# EAGLE schematic VCO (EAGLE 9.5.1)
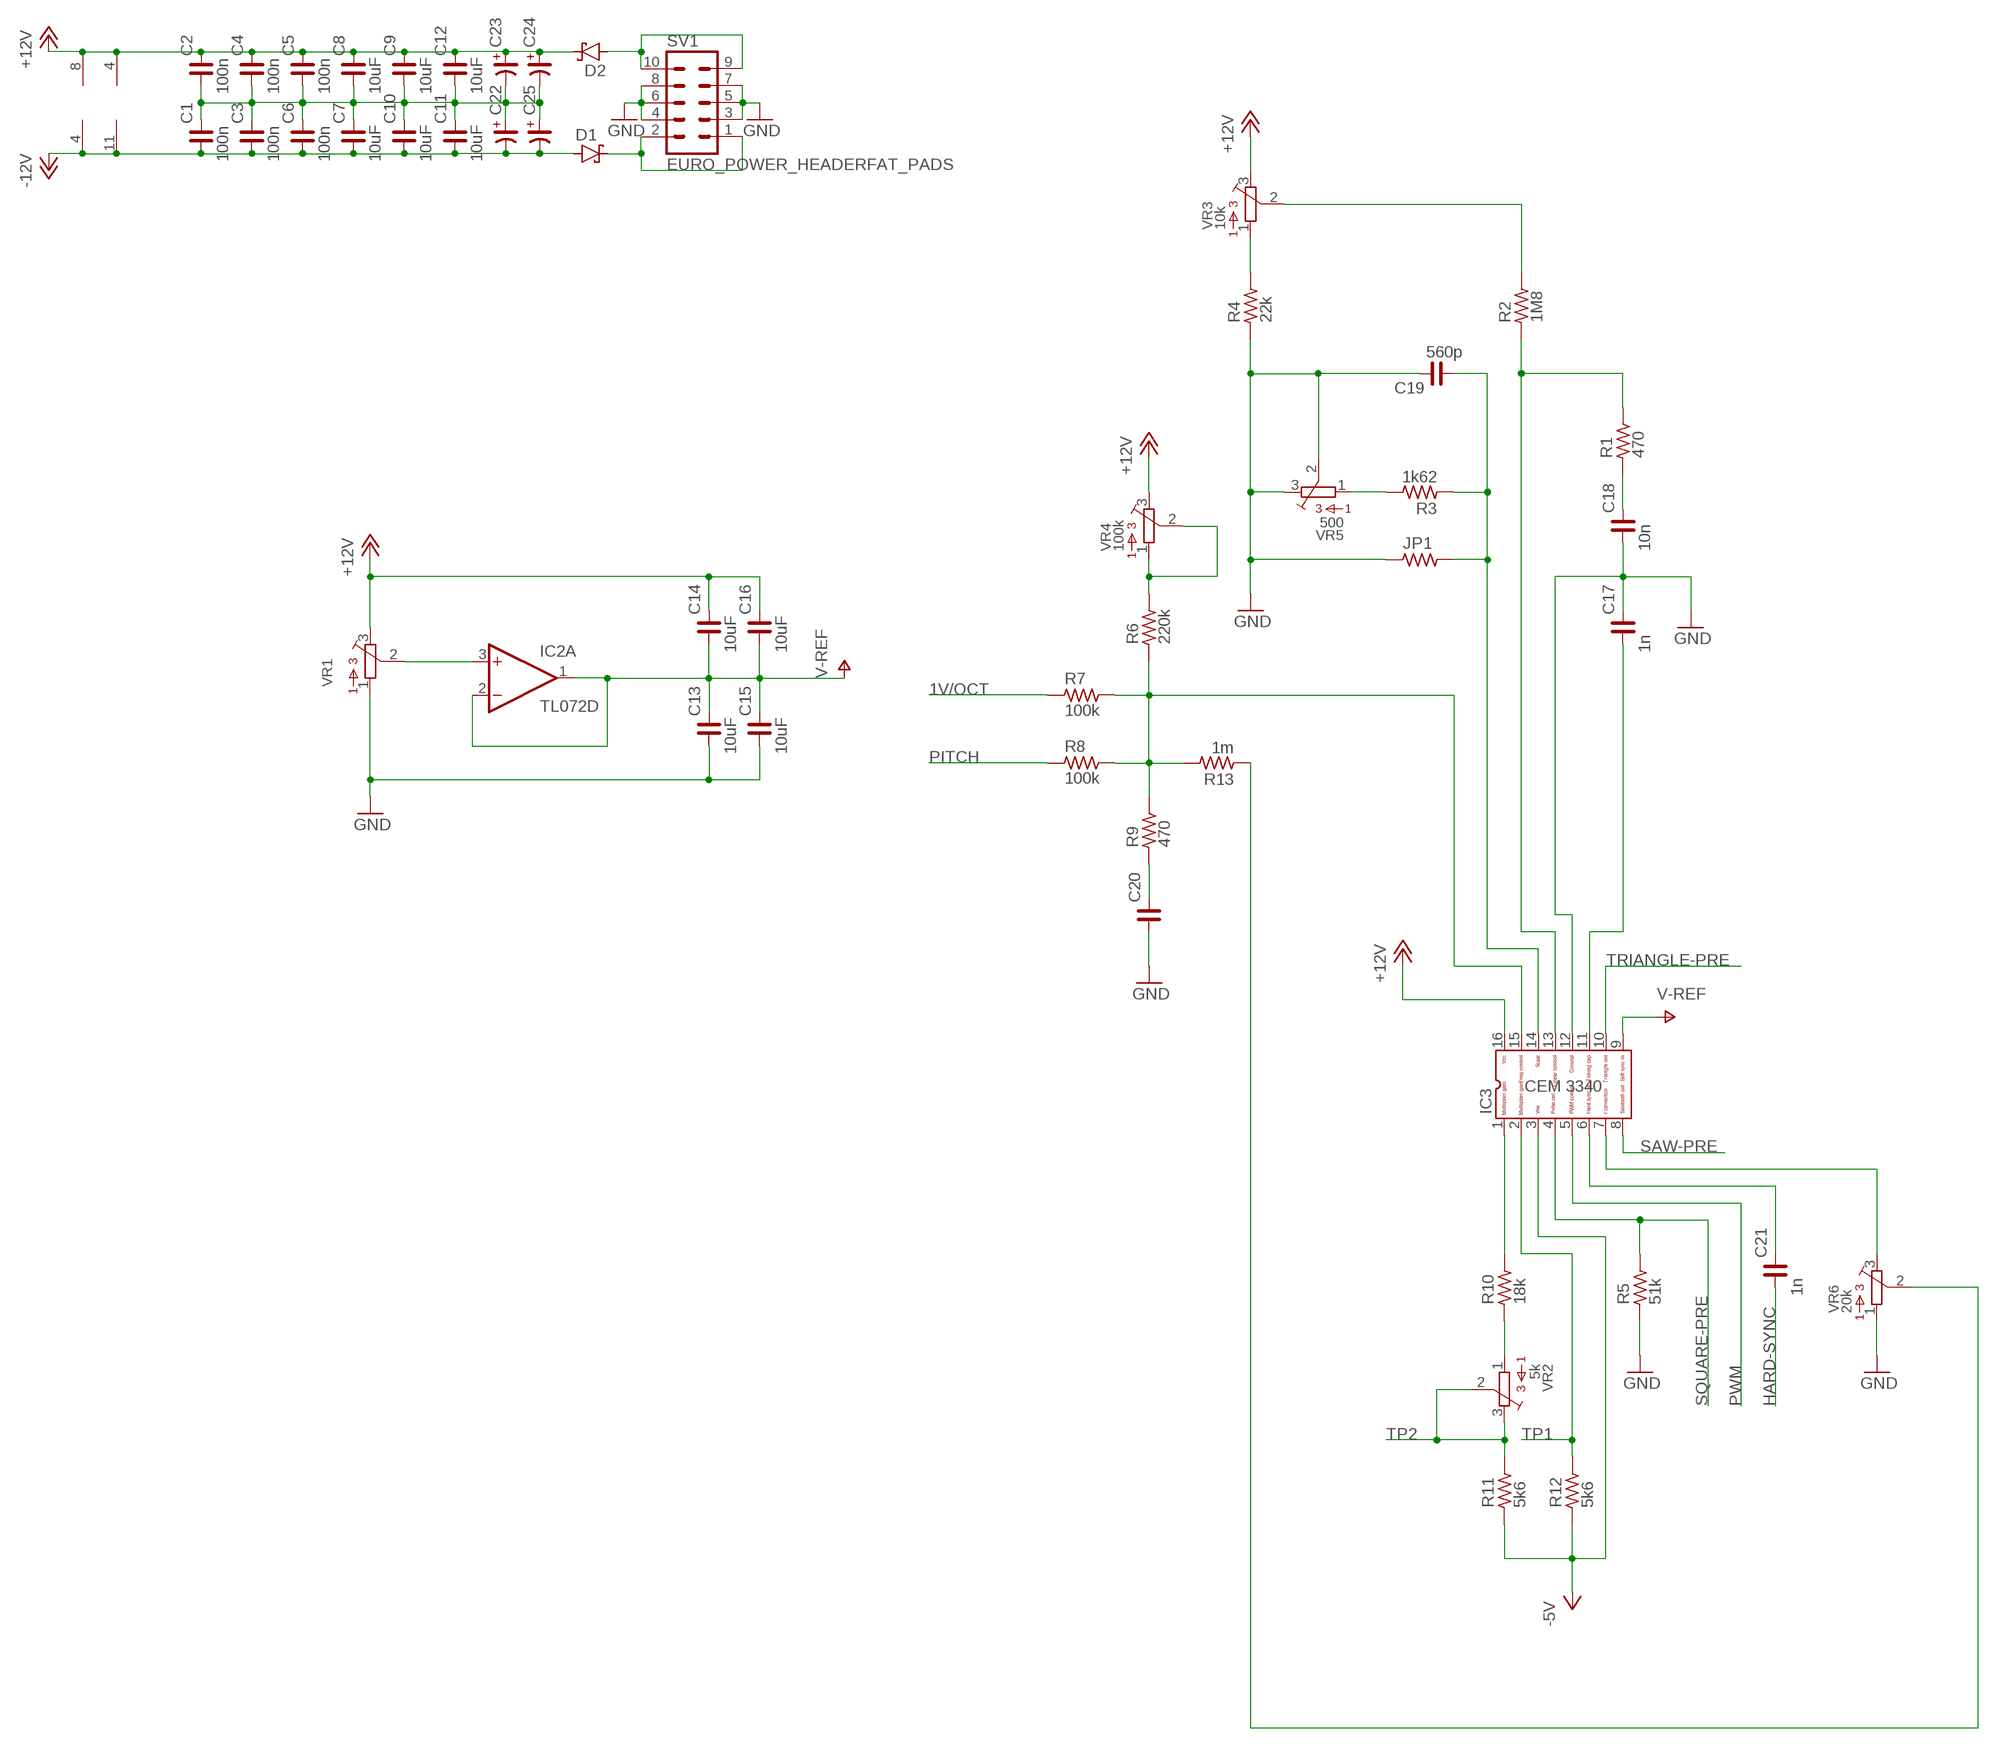
[diagram p0: schematic, sheet 1, part 1 of 2]
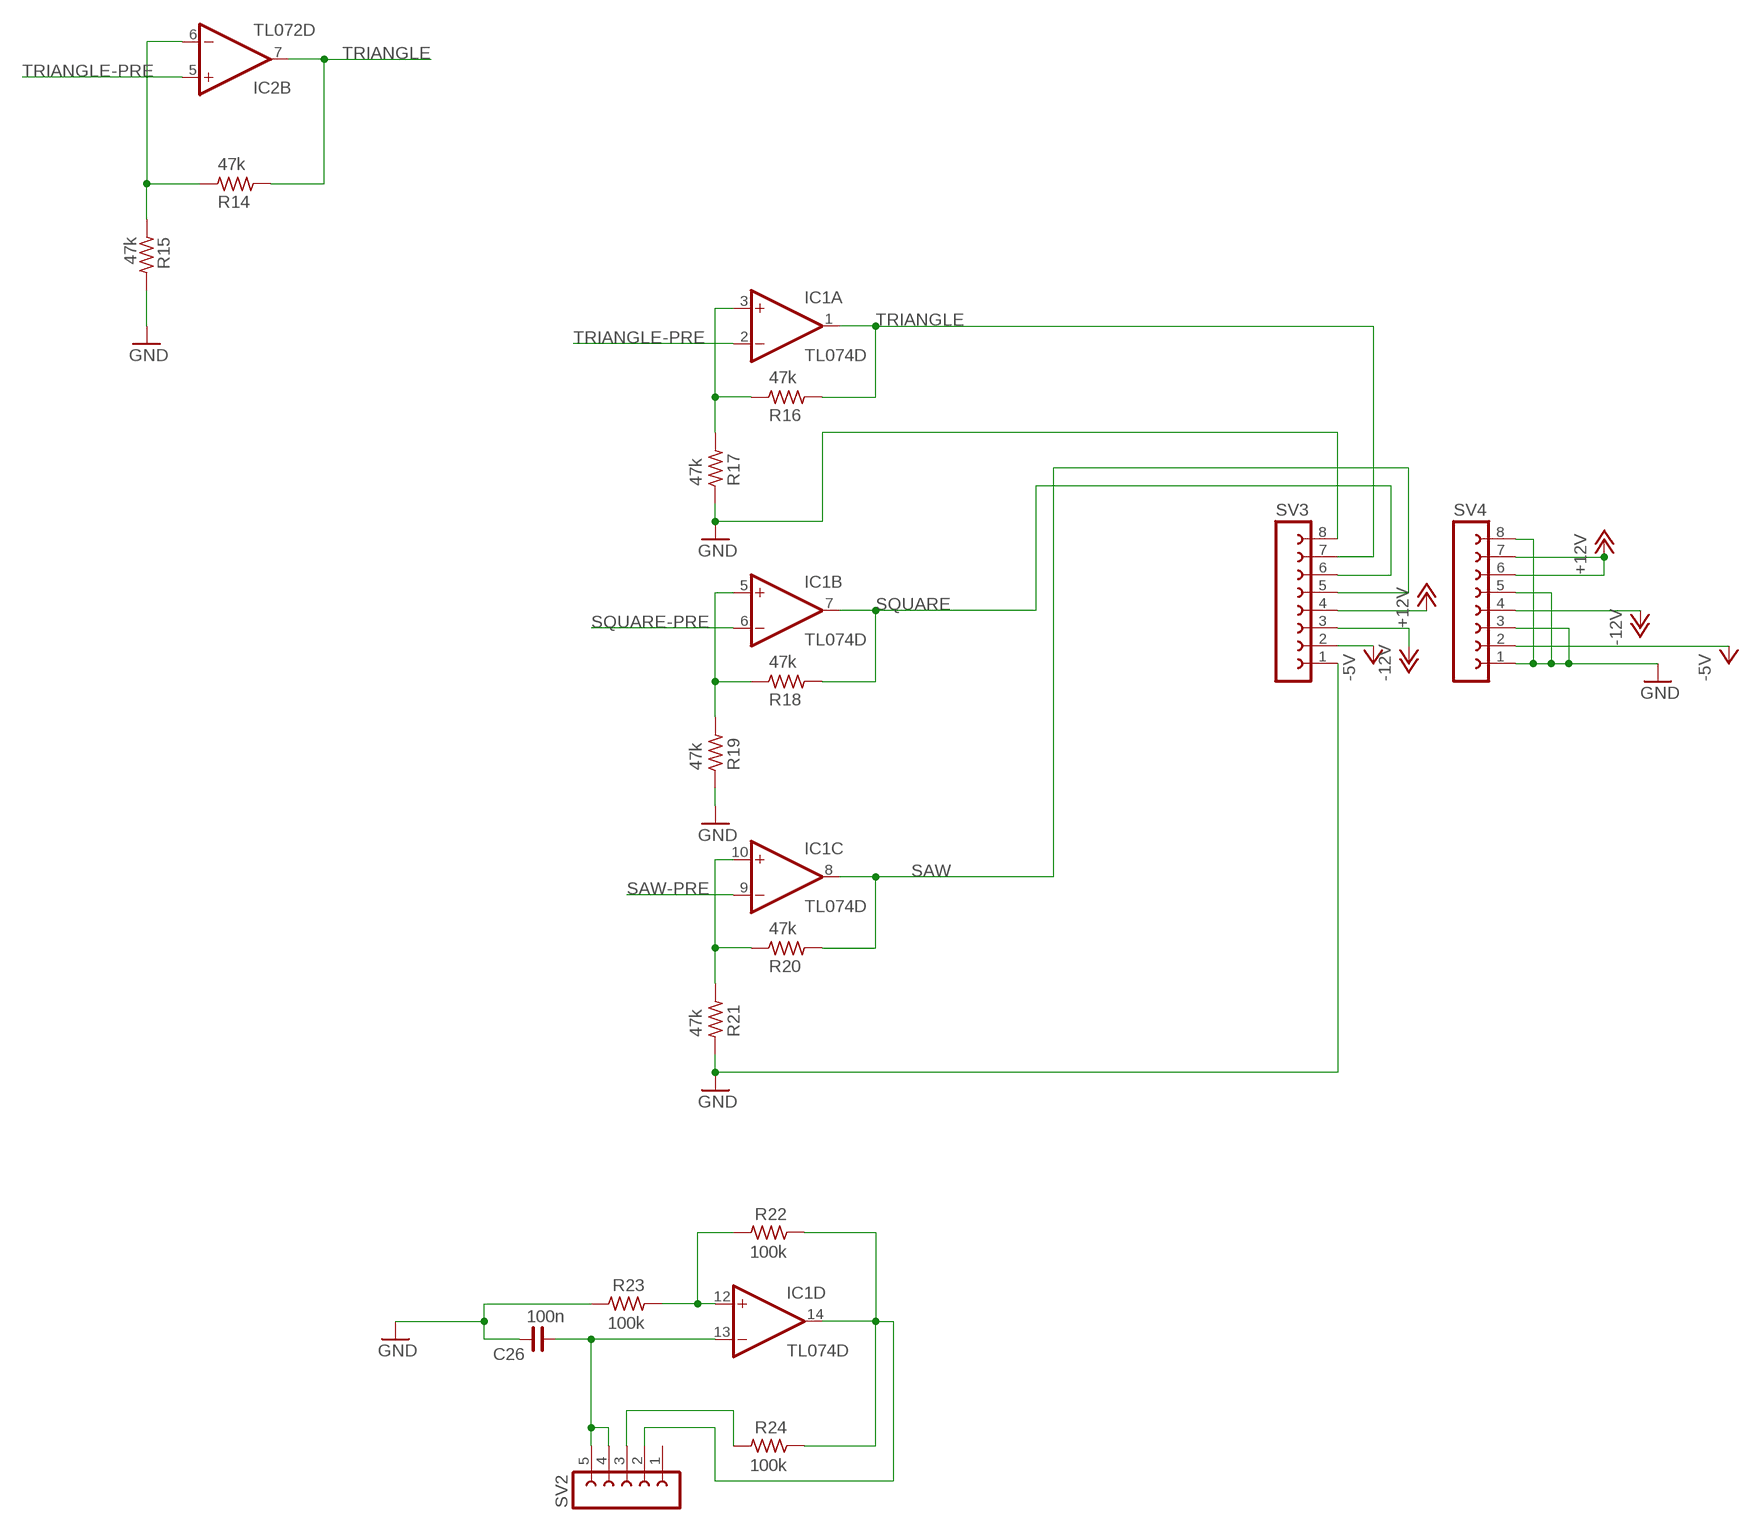
[diagram p1: schematic, sheet 1, part 2 of 2]

## Parts
C1  100n  C_0402  [C0402]
C2  100n  C_0402  [C0402]
C3  100n  C_0402  [C0402]
C4  100n  C_0402  [C0402]
C5  100n  C_0402  [C0402]
C6  100n  C_0402  [C0402]
C7  10uF  C_0402  [C0402]
C8  10uF  C_0402  [C0402]
C9  10uF  C_0402  [C0402]
C10  10uF  C_0402  [C0402]
C11  10uF  C_0402  [C0402]
C12  10uF  C_0402  [C0402]
C13  10uF  C_0402  [C0402]
C14  10uF  C_0402  [C0402]
C15  10uF  C_0402  [C0402]
C16  10uF  C_0402  [C0402]
C17  1n  C_0402  [C0402]
C18  10n  C_0402  [C0402]
C19  560p  C_0402  [C0402]
C20  C_0402  [C0402]
C21  1n  C_0402  [C0402]
C22  CP_7343  [C7343/T]
C23  CP_7343  [C7343/T]
C24  CP_7343  [C7343/T]
C25  CP_7343  [C7343/T]
C26  100n  C_0402  [C0402]
D1  SCHOTTKY-DIODESMC  [SMC]
D2  SCHOTTKY-DIODESMC  [SMC]
IC1  TL074D  [SO14]
IC2  TL072D  [SO08]
IC3  CEM3340  [DIL16]
JP1  R_0603  [R0603]
R1  470  R_0402  [R0402]
R2  1M8  R_0402  [R0402]
R3  1k62  R_0402  [R0402]
R4  22k  R_0402  [R0402]
R5  51k  R_0603  [R0603]
R6  220k  R_0603  [R0603]
R7  100k  R_0603  [R0603]
R8  100k  R_0603  [R0603]
R9  470  R_0603  [R0603]
R10  18k  R_0603  [R0603]
R11  5k6  R_0603  [R0603]
R12  5k6  R_0603  [R0603]
R13  1m  R_0603  [R0603]
R14  47k  R_0603  [R0603]
R15  47k  R_0603  [R0603]
R16  47k  R_0603  [R0603]
R17  47k  R_0603  [R0603]
R18  47k  R_0603  [R0603]
R19  47k  R_0603  [R0603]
R20  47k  R_0603  [R0603]
R21  47k  R_0603  [R0603]
R22  100k  R_0603  [R0603]
R23  100k  R_0603  [R0603]
R24  100k  R_0603  [R0603]
SV1  EURO_POWER_HEADERFAT_PADS  [EURO_PWR_HEADER_FAT]
SV2  FE05-1  [FE05-1]
SV3  FE08-1  [FE08]
SV4  FE08-1  [FE08]
VR1  BOURNS_3362P_TRIMMERP  [BOURNS_3362P_TRIMMER]
VR2  5k  BOURNS_3362P_TRIMMERP  [BOURNS_3362P_TRIMMER]
VR3  10k  BOURNS_3362P_TRIMMERP  [BOURNS_3362P_TRIMMER]
VR4  100k  BOURNS_3362P_TRIMMERP  [BOURNS_3362P_TRIMMER]
VR5  500  BOURNS_3362P_TRIMMERP  [BOURNS_3362P_TRIMMER]
VR6  20k  BOURNS_3362P_TRIMMERP  [BOURNS_3362P_TRIMMER]

## Nets
1V/OCT: R7.1
+12V: C2.2 C4.2 C5.2 C8.2 C9.2 C12.2 C14.2 C16.2 C23.+ C24.+ D2.C IC1.4(P:V+) IC2.8(P:V+) IC3.16 SV3.4 SV4.6 SV4.7 VR1.3 VR3.3 VR4.3
-5V: IC3.3 R11.1 R12.1 SV3.2 SV4.2
-12V: C1.1 C3.1 C6.1 C7.1 C10.1 C11.1 C22.- C25.- D1.A IC1.11(P:V-) IC2.4(P:V-) SV3.3 SV4.4
GND: C13.1 C15.1 C17.2 C18.1 C19.2 C20.1 C26.2 IC3.12 JP1.1 R4.1 R5.1 R15.2 R17.1 R19.1 R21.1 R23.2 SV1.3 SV1.4 SV1.5 SV1.6 SV1.7 SV1.8 SV3.1 SV3.8 SV4.1 SV4.3 SV4.5 SV4.8 VR1.1 VR5.2 VR5.3 VR6.1
HARD-SYNC: C21.1
N$1: IC2.3(A:+IN) VR1.2
N$2: C18.2 R1.1
N$3: D2.A SV1.9 SV1.10
N$4: D1.C SV1.1 SV1.2
N$5: IC3.13 R1.2 R2.1
N$6: C1.2 C2.1 C3.2 C4.1 C5.1 C6.2 C7.2 C8.1 C9.1 C10.2 C11.2 C12.1 C22.+ C23.- C24.- C25.+
N$7: IC3.7 VR6.3
N$8: C17.1 IC3.11
N$9: R3.2 VR5.1
N$10: IC3.15 R6.1 R7.2 R8.2 R9.2 R13.2
N$11: C19.1 IC3.14 JP1.2 R3.1
N$12: R4.2 VR3.1
N$13: R2.2 VR3.2
N$14: C21.2 IC3.6
N$15: R6.2 VR4.1 VR4.2
N$16: C20.2 R9.1
N$17: R10.1 VR2.1
N$18: R13.1 VR6.2
N$19: IC2.6(B:-IN) R14.1 R15.1
N$20: IC1.10(C:+IN) R20.1 R21.2
N$21: IC3.1 R10.2
N$22: IC1.5(B:+IN) R18.1 R19.2
N$23: IC1.3(A:+IN) R16.1 R17.2
N$26: C26.1 IC1.13(D:-IN) SV2.4 SV2.5
N$29: IC1.12(D:+IN) R22.2 R23.1
N$30: IC1.14(D:OUT) R22.1 R24.1 SV2.2
N$32: R24.2 SV2.3
PITCH: R8.1
PWM: IC3.5
SAW: IC1.8(C:OUT) R20.2 SV3.5
SAW-PRE: IC1.9(C:-IN) IC3.8
SQUARE: IC1.7(B:OUT) R18.2 SV3.6
SQUARE-PRE: IC1.6(B:-IN) IC3.4 R5.2
TP1: IC3.2 R12.2
TP2: R11.2 VR2.2 VR2.3
TRIANGLE: IC1.1(A:OUT) IC2.7(B:OUT) R14.2 R16.2 SV3.7
TRIANGLE-PRE: IC1.2(A:-IN) IC2.5(B:+IN) IC3.10
V+: C13.2 C14.1 C15.2 C16.1 IC2.1(A:OUT) IC2.2(A:-IN) IC3.9 ; supply symbol labelled V-REF
Unconnected: SV2.1

## Library data of the parts
C1-C21 C26 = rc-master-smd:C_: NON-POLARIZED CAP
C22-C25 = rc-master-smd:CP_: POLARIZED CAP
D1 D2 = diode:SCHOTTKY-DIODE: Schottky Diode
IC1 = linear:TL074: OP AMP
IC2 = linear:TL072: OP AMP
IC3 = CEM:CEM3340: CEM 3340 VCO
JP1 R1-R24 = rc-master-smd:R_: RESISTOR
SV1 = MusicThingModular:EURO_POWER_HEADER: Power Header 10 pin power header for Eurorack Power Supplies Variants with fatter pads for easier soldering, and the LOCK variant which has 5mil offset pins to hold the component in place before soldering
SV2 = con-lsta:FE05-1: FEMALE HEADER; OC_FARNELL: unknown; OC_NEWARK: unknown
SV3 SV4 = con-lsta:FE08-1: FEMALE HEADER; OC_FARNELL: unknown; OC_NEWARK: unknown
VR1-VR6 = MusicThingModular:BOURNS_3362P_TRIMMER: 3362 Series 1/4" Square Trimmer